# EAGLE design RPi (EAGLE 7.1.0)
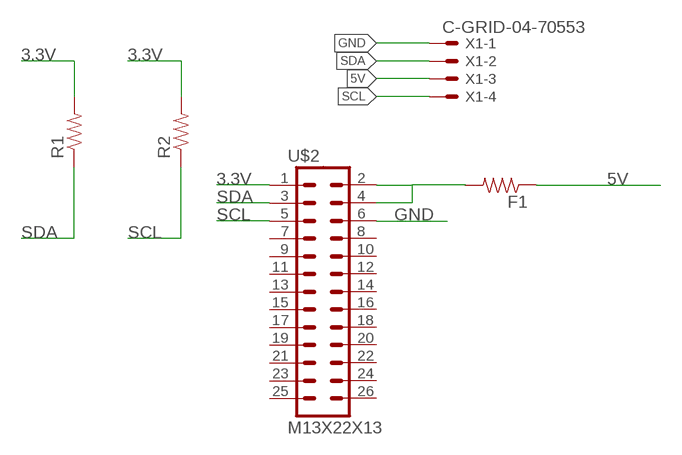
[diagram p0: schematic, sheet 1]

## Parts
F1  RESISTOR0805-RES  [0805]
R1  RESISTOR0805-RES  [0805]
R2  RESISTOR0805-RES  [0805]
U$2  M13X22X13  [2X13]
X1  C-GRID-04-70553  [70553-04]

## Nets
3.3V: R1.2 R2.2 U$2.1
5V: F1.1 X1.3
GND: U$2.6 X1.1
N$2: F1.2 U$2.2 U$2.4
SCL: R2.1 U$2.5 X1.4
SDA: R1.1 U$2.3 X1.2
Unconnected: U$2.7 U$2.8 U$2.9 U$2.10 U$2.11 U$2.12 U$2.13 U$2.14 U$2.15 U$2.16 U$2.17 U$2.18 U$2.19 U$2.20 U$2.21 U$2.22 U$2.23 U$2.24 U$2.25 U$2.26

## Library data of the parts
F1 R1 R2 = SparkFun-Resistors:RESISTOR: Resistor Basic schematic elements and footprints for 0603, 1206, and PTH resistors.
U$2 = SparkFun-Connectors:M13X2: 0.1" spaced headers
X1 = con-molex:C-GRID-04: CONNECTOR wire to board 2.54 mm (0.100") pitch header; OC_FARNELL: unknown; OC_NEWARK: unknown

## Board
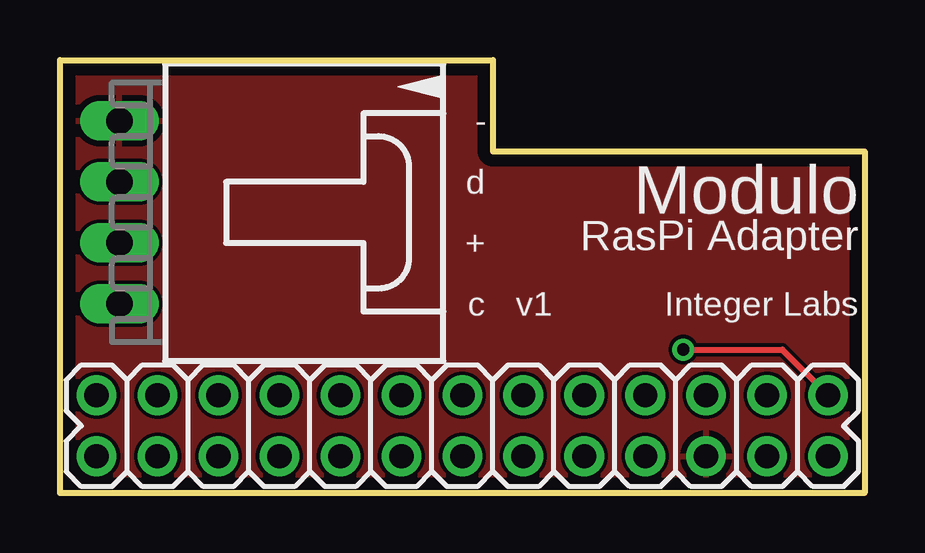
[diagram p1: board, top side]
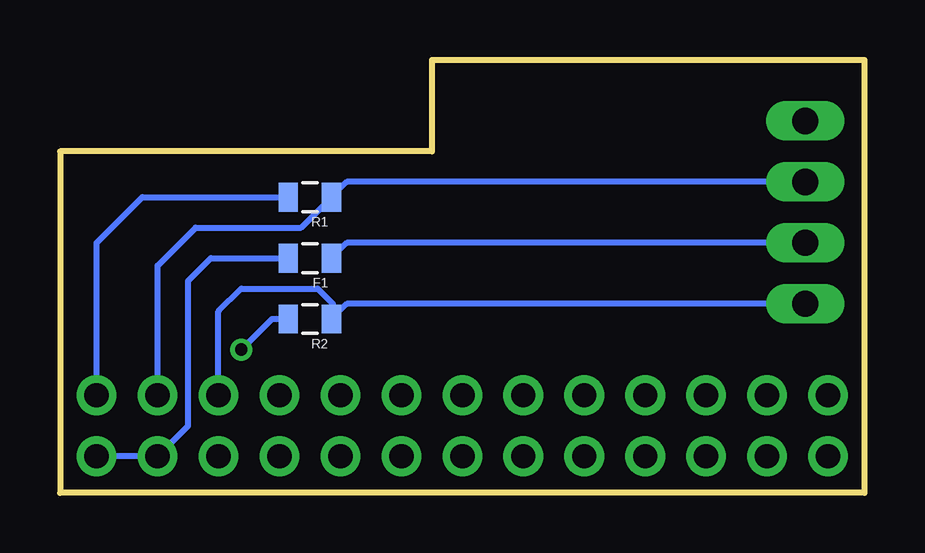
[diagram p2: board, bottom side, seen from below]

Size 33.53 x 18.03 mm. Coordinates in mm from the lower left corner, seen from the top.
Outline: 0,18.03 18.03,18.03 18.03,14.22 33.53,14.22 33.53,0 0,0 0,18.03
Copper layers (1*16): Top 0.0178mm / dielectric 59mil / Bottom 0.0178mm
Design rules "SSC-EAGLE-2Lyr_v1.0.0.3": minimum track width 6mil, minimum drill 14mil, track to track 6mil, track to pad 6mil, pad to pad 6mil, via to via 6mil, smd to smd 6mil, copper to edge 20mil, drill to drill 16mil, minimum pad ring 8mil, minimum via ring 8mil, stop-mask expansion 3mil, vias tented up to drill 0mil, thermal gap 10mil

### Footprints (pad centres in the part's own frame; a part is rotated, then mirrored left to right if it is on the bottom)
0805 = smd 0.8 x 1.2: 1 -0.9,0; 2 0.9,0
2X13 = drill 1.016 pad 1.651: 1 0,0; 2 0,2.54; 3 2.54,0; 4 2.54,2.54; 5 5.08,0; 6 5.08,2.54; 7 7.62,0; 8 7.62,2.54; 9 10.16,0; 10 10.16,2.54; 11 12.7,0; 12 12.7,2.54; 13 15.24,0; 14 15.24,2.54; 15 17.78,0; 16 17.78,2.54; 17 20.32,0; 18 20.32,2.54; 19 22.86,0; 20 22.86,2.54; 21 25.4,0; 22 25.4,2.54; 23 27.94,0; 24 27.94,2.54; 25 30.48,0; 26 30.48,2.54
70553-04 = drill 1.092 long: 1 -3.81,-7.62; 2 -1.27,-7.62; 3 1.27,-7.62; 4 3.81,-7.62

### Placement (x,y rotation side)
F1  23.11,9.78 180 bottom
R1  23.11,12.32 180 bottom
R2  23.11,7.24 180 bottom
U$2  32,4.06 180 top
X1  10.1,11.68 270 top

### Tracks (layer width: path | path; a pad name or v marks a point on that pad's centre or on a via)
3.3V  (via drill 0.51)
  Top 0.254: v25.97,5.97 30.1,5.97 U$2.1
  Bottom 0.254: U$2.1 32,10.41 30.1,12.32 R1.2 | R2.2 24.7,7.24 v25.97,5.97
5V
  Bottom 0.254: X1.3 21.58,10.41 F1.1
GND
  pour Top: 33.59,0.57 33.59,14.22 19.3,14.22 19.3,18.03 0.25,18.03 0.25,0.25
N$2
  Bottom 0.254: U$2.2 U$2.4 28.19,2.79 28.19,8.83 27.24,9.78 F1.2
SCL
  Bottom 0.254: U$2.5 26.92,7.56 25.97,8.51 22.8,8.51 22.16,7.87 22.16,7.29 R2.1 21.58,7.87 X1.4
SDA
  Bottom 0.254: U$2.3 29.46,9.46 27.88,11.05 23.48,11.05 R1.1 21.58,12.95 X1.2

### Text on the board
tPlace: - | d | Modulo | + | RasPi Adapter | c | v1 | Integer Labs